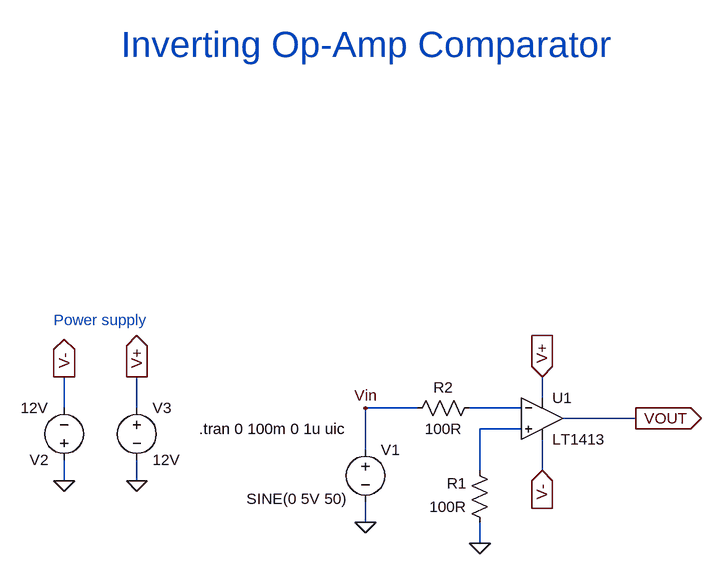
[diagram p0: schematic Op-Amp Inverting Comparator.asc]
Op-Amp Inverting Comparator.asc, the LTspice schematic file:
Version 4.1
SHEET 1 880 680
WIRE 224 144 224 112
WIRE -512 160 -512 112
WIRE -400 160 -400 112
WIRE 32 160 -48 160
WIRE 192 160 112 160
WIRE 368 176 256 176
WIRE 192 192 128 192
WIRE -48 224 -48 160
WIRE 128 256 128 192
WIRE 224 256 224 208
WIRE -512 272 -512 240
WIRE -400 272 -400 240
WIRE -48 336 -48 304
WIRE 128 368 128 336
FLAG 128 368 0
FLAG -48 336 0
FLAG -400 112 V+
IOPIN -400 112 Out
FLAG -400 272 0
FLAG -512 272 0
FLAG -512 112 V-
IOPIN -512 112 Out
FLAG 224 112 V+
IOPIN 224 112 In
FLAG 224 256 V-
IOPIN 224 256 In
FLAG 368 176 VOUT
IOPIN 368 176 Out
FLAG -48 160 Vin
SYMBOL OpAmps\\LT1413 224 112 R0
SYMATTR InstName U1
SYMBOL res 128 144 R90
WINDOW 0 0 56 VBottom 2
WINDOW 3 32 56 VTop 2
SYMATTR InstName R2
SYMATTR Value 100R
SYMBOL res 144 352 R180
WINDOW 0 36 76 Left 2
WINDOW 3 36 40 Left 2
SYMATTR InstName R1
SYMATTR Value 100R
SYMBOL voltage -48 208 R0
WINDOW 3 -183 92 Left 2
WINDOW 123 0 0 Left 0
WINDOW 39 0 0 Left 0
SYMATTR InstName V1
SYMATTR Value SINE(0 5V 50)
SYMBOL voltage -512 256 R180
WINDOW 123 0 0 Left 0
WINDOW 39 0 0 Left 0
SYMATTR InstName V2
SYMATTR Value 12V
SYMBOL voltage -400 144 R0
WINDOW 123 0 0 Left 0
WINDOW 39 0 0 Left 0
SYMATTR InstName V3
SYMATTR Value 12V
TEXT -424 -400 Left 5 ;Inverting Op-Amp Comparator
TEXT -528 24 Left 2 ;Power supply
TEXT -304 192 Left 2 !.tran 0 100m 0 1u uic

The netlist it stands for:
* Op-Amp Inverting Comparator.asc
X§U1 N002 N001 V+ V- VOUT LT1413  ; pins In+ In- V+ V- OUT
R2 N001 Vin 100R
R1 0 N002 100R
V1 Vin 0 SINE(0 5V 50)
V2 0 V- 12V
V3 V+ 0 12V
* Inverting Op-Amp Comparator
* Power supply
.tran 0 100m 0 1u uic
.lib LTC.lib
.backanno
.end